# Altium project Refreshmate_sem1.PrjPcb
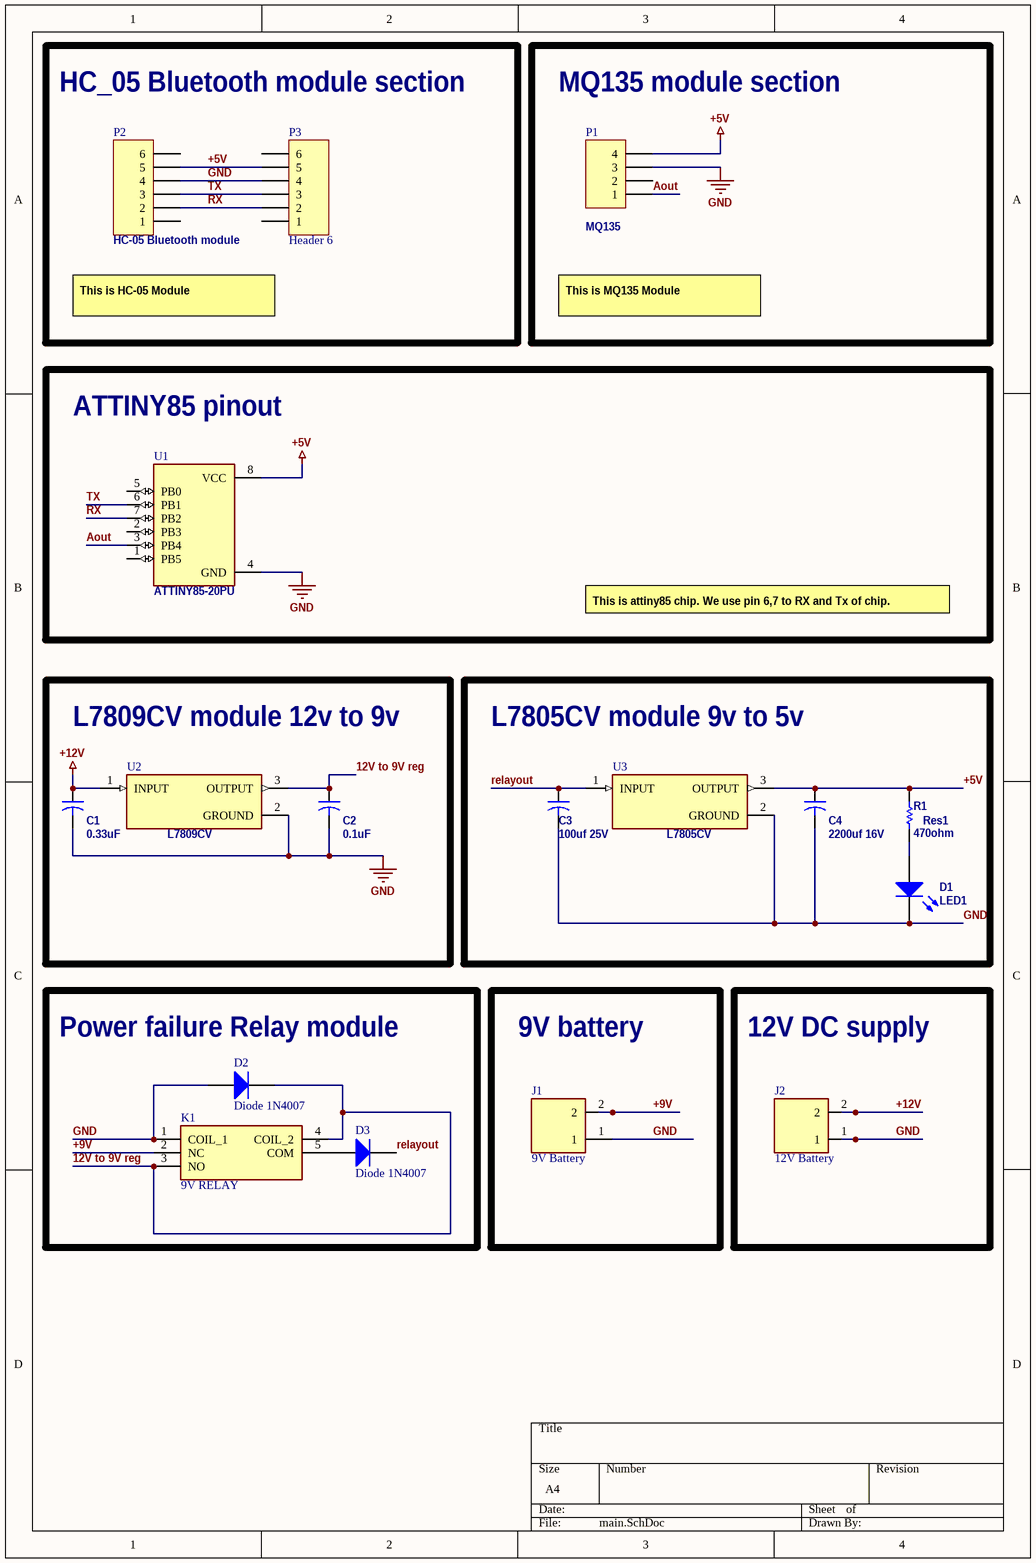
[diagram p0: main.SchDoc]
Designer: L.H.H.Maduwantha; Start Date: 15/07/2023; Title: Refreshmate
1 sheet, 17 parts. Net scope: global (net labels, ports and power ports of the same name join across sheets).
Board file: main.PcbDoc

## Sheet main.SchDoc: Refreshmate
size A4 portrait; SheetNumber: 1; SheetTotal: 1

### Parts
C1  0.33uF  [CAPR5-4X5]
C2  0.1uF  [CAPR5-4X5]
C3  100uf 25V  [CAPR5-4X5]
C4  2200uf 16V  [CAPR5-4X5]
D1  LED1  [LED-1]
D2  Diode 1N4007  [DO-41]
D3  Diode 1N4007  [DO-41]
J1  9V Battery  [HANDSON_KF301-2P]
J2  12V Battery  [HANDSON_KF301-2P]
K1  9V RELAY  [JQC3FT731Z12VDC]
P1  MQ135  [HDR1X4]
P2  HC-05 Bluetooth module  [HDR1X6]
P3  Header 6  [HDR1X6]
R1  Res1  value 470ohm  [AXIAL-0.3]
U1  ATTINY85-20PU  [DIP762W46P254L927H533Q8B]
U2  L7809CV  [TO255P1040X460X1968-3]
U3  L7805CV  [TO255P1040X460X1968-3]

### Blocks framed on the sheet
HC_05 Bluetooth module section: P2 P3
MQ135 module section: P1
ATTINY85 pinout: U1
L7809CV module 12v to 9v: C1 C2 U2
L7805CV module 9v to 5v: C3 C4 D1 R1 U3
Power failure Relay module: D2 D3 K1
9V battery: J1
12V DC supply: J2

### Nets
+5V: C4.1 P1.4 P2.5 P3.5 R1.2 U1.8(VCC) U3.3(OUTPUT)
+12V: C1.1 J2.2 U2.1(INPUT)
GND: C1.2 C2.2 C3.2 C4.2 D1.2(K) D2.1(A) J1.1 J2.1 K1.1(COIL_1) P1.3 P2.4 P3.4 U1.4(GND) U2.2(GROUND) U3.2(GROUND)
12V to 9V reg: C2.1 D2.2(K) K1.3(NO) K1.4(COIL_2) U2.3(OUTPUT)
+9V: J1.2 K1.2(NC)
Aout: P1.1 U1.3(PB4)
relayout: C3.1 D3.2(K) U3.1(INPUT)
RX: P2.2 P3.2 U1.7(PB2)
TX: P2.3 P3.3 U1.6(PB1)
NetD1_1: D1.1(A) R1.1
NetD3_1: D3.1(A) K1.5(COM)

Not connected (* = marked no-connect by the designer): P1 2; P2 1 6; P3 1 6; U1 1(PB5) 2(PB3) 5(PB0)

### Notes on the sheet
- This is HC-05 Module
- This is MQ135 Module
- This is attiny85 chip. We use pin 6,7 to RX and Tx of chip.

### Library data of the parts
C1-C4 = Cap2: Capacitor; Published: 23-Sep-2002; PackageReference: CAPR5-4X5; Publisher: Altium Limited; PackageDescription: Capacitor; 2 Leads
D1 = LED1: Typical RED GaAs LED; Published: 8-Jun-2000; LatestRevisionDate: 08-Jul-2005; LatestRevisionNote: Mech Layer 1 removed.; PackageReference: LED-1; Publisher: Altium Limited; PackageDescription: LED; 2 Leads
D2 D3 = Diode 1N4007: 1 Amp General Purpose Rectifier; Published: 8-Jun-2000; LatestRevisionDate: 17-Jul-2002; LatestRevisionNote: Re-released for DXP Platform.; DatasheetVersion: 1998; PackageVersion: Aug-1999; PackageReference: DO-41; Publisher: Altium Limited; PackageDescription: Diode, Axial; Body 5.2 x 2.7 mm (LxDia. max), Lead Dia. 0.86 mm (max); Code_JEDEC: DO-204-AL; ComponentLink1Description: Manufacturer Link; ComponentLink1URL: http://www.fairchildsemi.com/; ComponentLink2Description: Datasheet; ComponentLink2URL: http://www.fairchildsemi.com/ds/1N%2F1N4001.pdf
J1 J2 = KF301-2P: 2 Pin Terminal Block 5mm Pitch; Price: None; Value: *; MP: KF301-2P; Package: None; Availability: Unavailable
K1 = JQC-3F-_T73_-1Z-12VDC: RELAY POWER 10A 12VDC 1C PCB TYPE (JS1) 5PIN QIANJ; Manufacturer_Name: QIANJI; Manufacturer_Part_Number: JQC-3F-(T73)-1Z-12VDC; Geometry.Height: 15.5mm; Mouser Part Number: *; Mouser Price/Stock: *; Arrow Part Number: *; Arrow Price/Stock: *; Datasheet Link: https://img.ozdisan.com/ETicaret_Dosya/341245_8627675.pdf
P1 = Header 4: Header, 4-Pin; LatestRevisionDate: 17-Jul-2002; LatestRevisionNote: Re-released for DXP Platform.; Publisher: Altium Limited
P2 P3 = Header 6: Header, 6-Pin; LatestRevisionDate: 17-Jul-2002; LatestRevisionNote: Re-released for DXP Platform.; Publisher: Altium Limited
R1 = Res1: Resistor; Published: 8-Jun-2000; LatestRevisionDate: 17-Jul-2002; LatestRevisionNote: Re-released for DXP Platform.; PackageReference: AXIAL-0.3; Publisher: Altium Limited; PackageDescription: Axial Device, Thru-Hole; 2 Leads; 0.3 in Pin Spacing
U1 = ATTINY85-20PU: AVR AVRÂ® ATtiny, Functional Safety (FuSa) Microcontroller IC 8-Bit 20MHz 8KB (4K x 16) FLASH 8-PDIP; MF: Microchip; MP: ATTINY85-20PU; Price: None; Purchase-URL: https://pricing.snapeda.com/search/part/ATTINY85-20PU/?ref=eda; Package: DIP-8 Atmel; Check_prices: https://www.snapeda.com/parts/ATTINY85-20PU/Microchip/view-part/42827/?ref=eda; Value: *; Availability: Good; SnapEDA_Link: https://www.snapeda.com/parts/ATTINY85-20PU/Microchip/view-part/42827/?ref=snap
U2 U3 = L7805CV: Linear Voltage Regulator IC Positive Fixed 1 Output 1.5A TO-220; MF: STMicroelectronics; SnapEDA_Link: https://www.snapeda.com/parts/L7805CV/STMicroelectronics/view-part/?ref=snap; Package: TO-220-3 ON Semiconductor; MP: L7805CV; Check_prices: https://www.snapeda.com/parts/L7805CV/STMicroelectronics/view-part/?ref=eda; Purchase-URL: https://pricing.snapeda.com/search/part/L7805CV/?ref=eda; Price: None; Value: *; Availability: In Stock